# EasyEDA schematic RGB-Controller.json
TITLE: 12v RGB WiFi Controller; REV: 0.4; Date: 2022-04-02; Sheet: 1/1; Drawn By: Sneer; Company: Zarus Labs
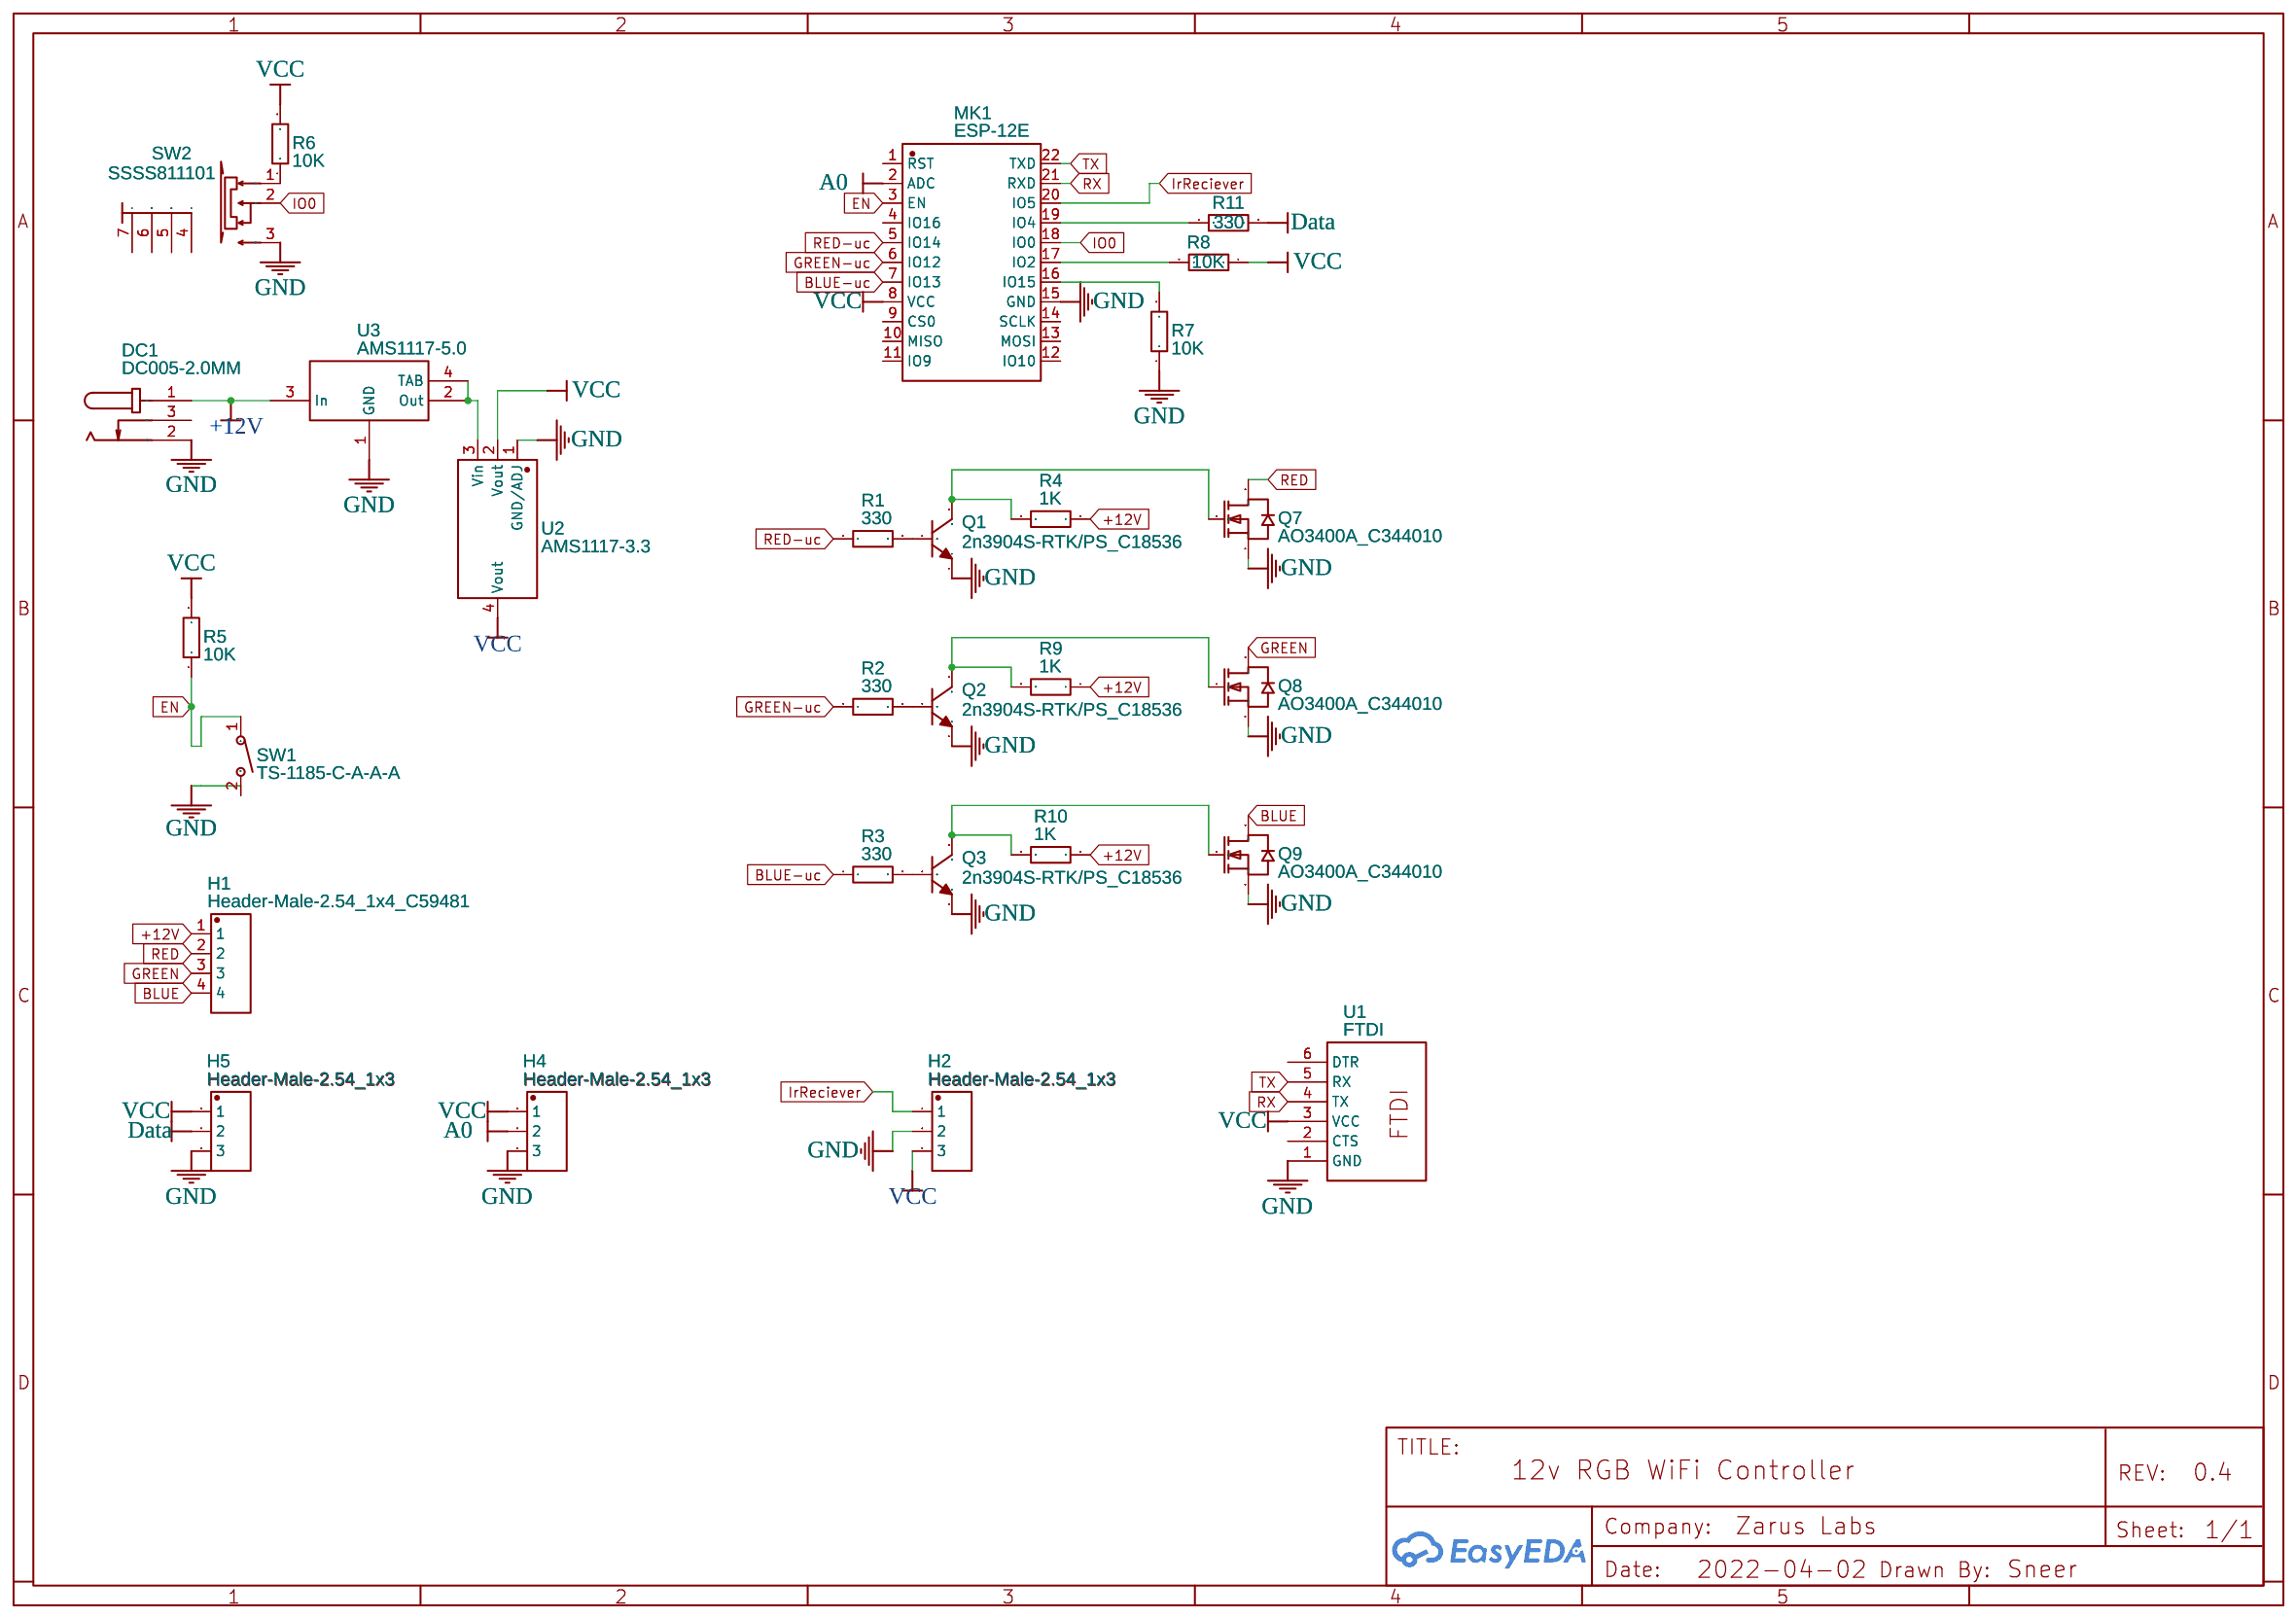
[diagram p0: schematic sheet]

## Parts
DC1  DC005-2.0MM  [DC-IN-TH_DC005]
H1  Header-Male-2.54_1x4_C59481  [HDR-TH_4P-P2.54-V]
H2  Header-Male-2.54_1x3  [HEADER-MALE-2.54_1X3]
H4  Header-Male-2.54_1x3  [HEADER-MALE-2.54_1X3]
H5  Header-Male-2.54_1x3  [HEADER-MALE-2.54_1X3]
MK1  ESP-12E  [WIFIM-SMD_ESP-12E]
Q1  2n3904S-RTK/PS_C18536  [SOT-23-3_L2.9-W1.3-P1.90-LS2.4-TR]
Q2  2n3904S-RTK/PS_C18536  [SOT-23-3_L2.9-W1.3-P1.90-LS2.4-TR]
Q3  2n3904S-RTK/PS_C18536  [SOT-23-3_L2.9-W1.3-P1.90-LS2.4-TR]
Q7  AO3400A_C344010  [SOT-23_L2.9-W1.3-P1.90-LS2.4-BR]
Q8  AO3400A_C344010  [SOT-23_L2.9-W1.3-P1.90-LS2.4-BR]
Q9  AO3400A_C344010  [SOT-23_L2.9-W1.3-P1.90-LS2.4-BR]
R1  330  [R0805]
R2  330  [R0805]
R3  330  [R0805]
R4  1K  [R1210]
R5  10K  [R1206]
R6  10K  [R1206]
R7  10K  [R1206]
R8  10K  [R1206]
R9  1K  [R1210]
R10  1K  [R1210]
R11  330  [R0805]
SW1  TS-1185-C-A-A-A  [SW-SMD_L4.0-W3.0-LS5.0-EH]
SW2  SSSS811101  [SW-SMD_SSSS811101]
U1  FTDI  [FTDI_PROG]
U2  AMS1117-3.3  [SOT-223-3_L6.5-W3.4-P2.30-LS7.0-BR]
U3  AMS1117-5.0  [SOT-223_L6.5-W3.5-P2.30-LS7.0-BR]

## Library data of the parts
DC1 = DC005-2.0MM: Supplier: LCSC; Manufacturer: SOFNG; Supplier Part: C111567
H1 = Header-Male-2.54_1x4_C59481: Supplier: LCSC; Manufacturer: ReliaPro; Manufacturer Part: Headers  Pins 1*4P; Supplier Part: C59481
H2 H4 H5 = Header-Male-2.54_1x3: Contributor: Destiny
MK1 = ESP-12E: Supplier: LCSC; Manufacturer: Ai-Thinker; Supplier Part: C89297; JLCPCB Part Class: Extended Part
Q1-Q3 = 2n3904S-RTK/PS_C18536: Supplier: LCSC; Manufacturer: KEC; Manufacturer Part: 2n3904S-RTK/PS; Supplier Part: C18536; JLCPCB Part Class: Extended Part
Q7-Q9 = AO3400A_C344010: Supplier: LCSC; Supplier Part: C344010; Manufacturer: Bourne Semicon (Shenzhen); Manufacturer Part: AO3400A; Contributor: LCSC; JLCPCB Part Class: Extended Part
R1-R3 R11 = 0805W8J0331T5E: Supplier: LCSC; Manufacturer: UniOhm; Supplier Part: C25306; JLCPCB Part Class: Extended Part
R4 R9 R10 = 1210W3J0102T5E: Supplier: LCSC; Manufacturer: UniOhm; Supplier Part: C25681; JLCPCB Part Class: Extended Part
R5-R8 = 1206W4F1002T5E: Supplier: LCSC; Manufacturer: UniOhm; Supplier Part: C17902; JLCPCB Part Class: Basic Part
SW1 = TS-1185-C-A-A-A: Supplier: LCSC; Supplier Part: C561518; Manufacturer: XKB Enterprise; Contributor: LCSC; JLCPCB Part Class: Extended Part
SW2 = SSSS811101: Supplier: LCSC; Manufacturer: ALPS; Supplier Part: C109335; JLCPCB Part Class: Extended Part
U1 = FTDI: Contributor: nematic.business
U2 = AMS1117-3.3: sourceId: dwIGgezVh; Supplier: LCSC; Manufacturer: AMS; Supplier Part: C6186; JLCPCB Part Class: Basic Part
U3 = AMS1117-5.0: sourceId: HltLFyQwq; Supplier: LCSC; Manufacturer: AMS; Supplier Part: C6187; JLCPCB Part Class: Basic Part

## Nets
+12V: DC1.1 H1.1 R4.1 R9.1 R10.1 U3.3(In)
GND: DC1.2 H2.2 H4.3 H5.3 MK1.15(GND) Q1.1(E) Q2.1(E) Q3.1(E) Q7.2(S) Q8.2(S) Q9.2(S) R7.1 SW1.2 SW2.3 U1.1(GND) U2.1(GND/ADJ) U3.1(GND)
VCC: H2.3 H4.1 H5.1 MK1.8(VCC) R5.2 R6.2 R8.1 U1.3(VCC) U2.2(Vout) U2.4(Vout)
A0: H4.2 MK1.2(ADC)
BLUE: H1.4 Q9.3(D)
BLUE-uc: MK1.7(IO13) R3.1
Data: H5.2 R11.2
EN: MK1.3(EN) R5.1 SW1.1
GREEN: H1.3 Q8.3(D)
GREEN-uc: MK1.6(IO12) R2.1
IO0: MK1.18(IO0) SW2.2
IrReciever: H2.1 MK1.20(IO5)
RED: H1.2 Q7.3(D)
RED-uc: MK1.5(IO14) R1.1
RX: MK1.21(RXD) U1.4(TX)
TX: MK1.22(TXD) U1.5(RX)
Net-(MK1-16): MK1.16(IO15) R7.2
Net-(MK1-17): MK1.17(IO2) R8.2
Net-(MK1-19): MK1.19(IO4) R11.1
Net-(Q1-2): Q1.2(B) R1.2
Net-(Q1-3): Q1.3(C) Q7.1(G) R4.2
Net-(Q2-2): Q2.2(B) R2.2
Net-(Q2-3): Q2.3(C) Q8.1(G) R9.2
Net-(Q3-2): Q3.2(B) R3.2
Net-(Q3-3): Q3.3(C) Q9.1(G) R10.2
Net-(R6-1): R6.1 SW2.1
Net-(U2-3): U2.3(Vin) U3.2(Out) U3.4(TAB)

Not connected (* = marked no-connect by the designer): DC1 3; MK1 1(RST) 4(IO16) 9(CS0) 10(MISO) 11(IO9) 12(IO10) 13(MOSI) 14(SCLK); SW2 4 5 6 7; U1 2(CTS) 6(DTR)
